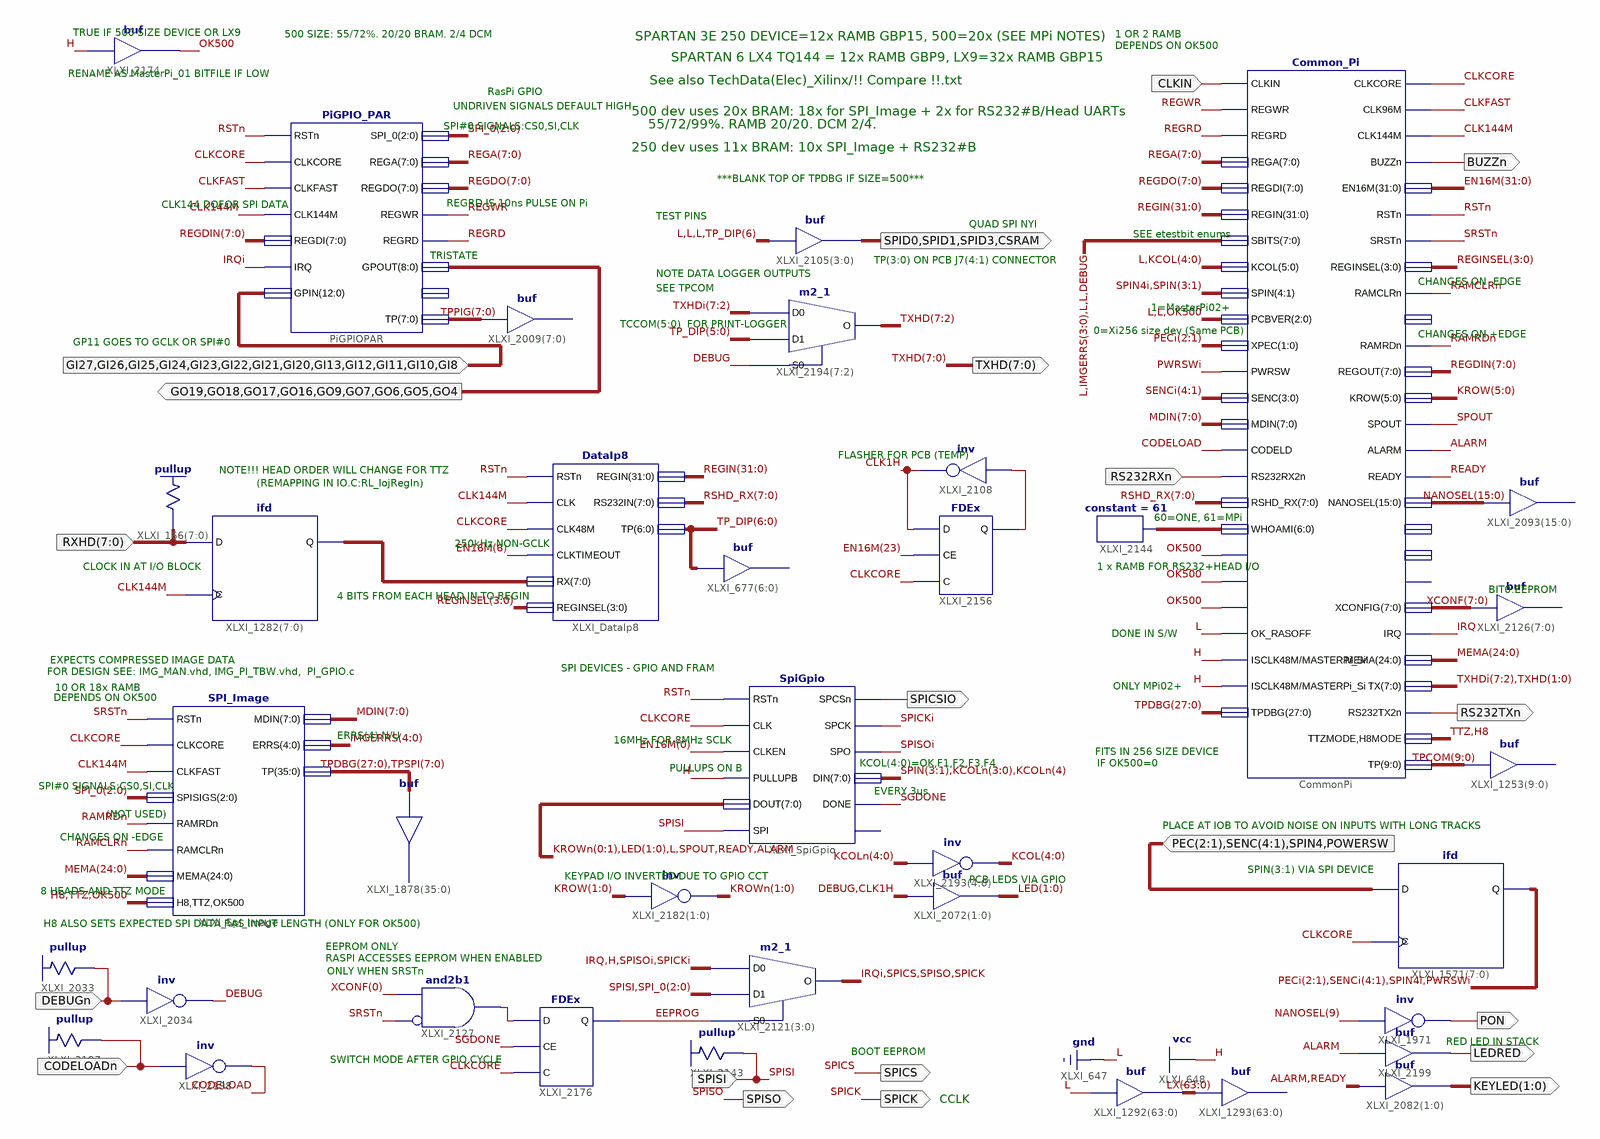
[diagram p0: schematic sheet 1]
// Xilinx ISE schematic MasterPi_02.sch (spartan3e) as structural Verilog: 36 symbols, 20 ports
module MasterPi_02 (
  input  DEBUGn,
  input  [7:0] RXHD,
  input  SPISI,
  input  RS232RXn,
  input  [2:1] PEC,
  input  [4:1] SENC,
  input  SPIN4,
  input  POWERSW,
  input  GI27,
  input  GI26,
  input  GI25,
  input  GI24,
  input  GI23,
  input  GI22,
  input  GI21,
  input  GI20,
  input  GI13,
  input  GI12,
  input  GI11,
  input  GI10,
  input  GI8,
  input  CODELOADn,
  input  CLKIN,
  output [1:0] KEYLED,
  output LEDRED,
  output PON,
  output SPICK,
  output SPICS,
  output SPISO,
  output SPICSIO,
  output BUZZn,
  output RS232TXn,
  output GO19,
  output GO18,
  output GO17,
  output GO16,
  output GO9,
  output GO7,
  output GO6,
  output GO5,
  output GO4,
  output [7:0] TXHD,
  output SPID0,
  output SPID1,
  output SPID3,
  output CSRAM
);

  wire ALARM, CLK1H, CLK144M, CLKCORE, CLKFAST, CODELOAD, DEBUG, EEPROG, H8, IRQ, IRQi, L, OK500, PWRSWi,
       RAMCLRn, RAMRDn, READY, REGRD, REGWR, RSTn, SGDONE, SPICKi, SPIN4i, SPISOi, SPOUT, SRSTn, TTZ,
       XLXN_184, XLXN_379;
  wire [1:0] KROWn, LED;
  wire [2:0] SPI_0;
  wire [2:1] PECi;
  wire [3:0] REGINSEL;
  wire [3:1] SPIN;
  wire [4:0] IMGERRS, KCOL, KCOLn;
  wire [4:1] SENCi;
  wire [5:0] KROW;
  wire [6:0] TP_DIP, XLXN_196;
  wire [7:0] MDIN, REGA, REGDIN, REGDO, RSHD_RX, TPPIG, TPSPI, XCONF, XLXN_33;
  wire [7:2] TXHDi;
  wire [9:0] TPCOM;
  wire [15:0] NANOSEL;
  wire [24:0] MEMA;
  wire [27:0] TPDBG;
  wire [31:0] EN16M, REGIN;
  wire [63:0] LX;

  \pullup  XLXI_2033 (.O(DEBUGn));
  not XLXI_2034 (DEBUG, DEBUGn);
  \pullup  XLXI_166[7:0] (.O(RXHD));
  ifd XLXI_1282[7:0] (.C(CLK144M), .D(RXHD), .Q(XLXN_33));
  assign LX = {64{L}};  // buf XLXI_1292[63..0], 64 bits wide
  // buf XLXI_1293[63..0] has open pins: I=LX, O=open
  assign KEYLED = {ALARM, READY};  // buf XLXI_2082[1..0], 2 bits wide
  not XLXI_1971 (PON, NANOSEL[9]);
  not XLXI_2108 (CLK1H, XLXN_184);
  FDEx XLXI_2156 (.C(CLKCORE), .CE(EN16M[23]), .D(CLK1H), .Q(XLXN_184));
  constant #(.CValue("61")) XLXI_2144 (.O(XLXN_196));
  m2_1 XLXI_2121[3:0] (
    .D0({IRQ, 1'b1, SPISOi, SPICKi}), .D1({SPISI, SPI_0}), .S0(EEPROG), .O({IRQi, SPICS, SPISO, SPICK}));
  \pullup  XLXI_2143 (.O(SPISI));
  ifd XLXI_1571[7:0] (.C(CLKCORE), .D({PEC, SENC, SPIN4, POWERSW}), .Q({PECi, SENCi, SPIN4i, PWRSWi}));
  // buf XLXI_2093[15..0] has open pins: I=NANOSEL, O=open
  // buf XLXI_2126[7..0] has open pins: I=XCONF, O=open
  FDEx XLXI_2176 (.C(CLKCORE), .CE(SGDONE), .D(XLXN_379), .Q(EEPROG));
  and XLXI_2127 (XLXN_379, ~SRSTn, XCONF[0]);  // and2b1
  SpiGpio XLXI_SpiGpio (
    .CLK(CLKCORE), .CLKEN(EN16M[0]), .PULLUPB(1'b1), .DIN({SPIN, KCOLn[3:0], KCOLn[4]}), .DONE(SGDONE),
    .DOUT({KROWn[0], KROWn[1], LED, L, SPOUT, READY, ALARM}), .RSTn(RSTn), .SPCK(SPICKi), .SPCSn(SPICSIO),
    .SPI(SPISI), .SPO(SPISOi));  // open: CYCLE
  assign KROWn = ~KROW[1:0];  // inv XLXI_2182[1..0], 2 bits wide
  assign LED = {DEBUG, CLK1H};  // buf XLXI_2072[1..0], 2 bits wide
  assign KCOL = ~KCOLn;  // inv XLXI_2193[4..0], 5 bits wide
  // buf XLXI_677[6..0] has open pins: I=TP_DIP, O=open
  DataIp8 XLXI_DataIp8 (
    .CLK(CLK144M), .CLK48M(CLKCORE), .CLKTIMEOUT(EN16M[6]), .REGIN(REGIN), .REGINSEL(REGINSEL),
    .RS232IN(RSHD_RX), .RSTn(RSTn), .RX(XLXN_33), .TP(TP_DIP));
  // buf XLXI_2009[7..0] has open pins: I=TPPIG, O=open
  buf XLXI_2174 (OK500, 1'b1);
  // buf XLXI_1253[9..0] has open pins: I=TPCOM, O=open
  \pullup  XLXI_2197 (.O(CODELOADn));
  not XLXI_2198 (CODELOAD, CODELOADn);
  buf XLXI_2199 (LEDRED, ALARM);
  m2_1 XLXI_2194[7:2] (.D0(TXHDi), .D1(TP_DIP[5:0]), .S0(DEBUG), .O(TXHD[7:2]));
  Common_Pi CommonPi (
    .ALARM(ALARM), .BUZZn(BUZZn), .CLK144M(CLK144M), .CLK96M(CLKFAST), .CLKCORE(CLKCORE), .CLKIN(CLKIN),
    .CODELD(CODELOAD), .EN16M(EN16M), .IRQ(IRQ), .ISCLK48M(1'b1), .KCOL({L, KCOL}), .KROW(KROW),
    .MASTERPi_Si(1'b1), .MDIN(MDIN), .MEMA(MEMA), .NANOSEL(NANOSEL), .OK_500(OK500), .OK_RASOFF(L),
    .OK_RS232(OK500), .OK_RSHEAD(OK500), .PCBVER({{2{L}}, OK500}), .PWRSW(PWRSWi), .RAMCLRn(RAMCLRn),
    .RAMRDn(RAMRDn), .READY(READY), .REGA(REGA), .REGDI(REGDO), .REGIN(REGIN), .REGINSEL(REGINSEL),
    .REGOUT(REGDIN), .REGRD(REGRD), .REGWR(REGWR), .RS232RX2n(RS232RXn), .RS232TX2n(RS232TXn),
    .RSHD_RX(RSHD_RX), .RSTn(RSTn), .SENC(SENCi), .SPIN({SPIN4i, SPIN}), .SPOUT(SPOUT), .SRSTn(SRSTn),
    .TP(TPCOM), .SBITS({L, IMGERRS[3:0], {2{L}}, DEBUG}), .TTZMODE(TTZ), .H8MODE(H8),
    .TX({TXHDi, TXHD[1:0]}), .WHOAMI(XLXN_196), .XCONFIG(XCONF), .XPEC(PECi), .TPDBG(TPDBG));  // open: FIRE_EN, HDATA0, HDATA0_EN, HREG0
  assign {SPID0, SPID1, SPID3, CSRAM} = {{3{L}}, TP_DIP[6]};  // buf XLXI_2105[3..0], 4 bits wide
  SPI_Image XLXI_Spi_Image (
    .CLKCORE(CLKCORE), .CLKFAST(CLK144M), .ERRS(IMGERRS), .H8(H8), .TTZ(TTZ), .OK500(OK500), .MDIN(MDIN),
    .MEMA(MEMA), .RAMCLRn(RAMCLRn), .RAMRDn(RAMRDn), .RSTn(SRSTn), .SPISIGS(SPI_0), .TP({TPDBG, TPSPI}));
  // buf XLXI_1878[35..0] has open pins: I={TPDBG, TPSPI}, O=open
  PiGPIO_PAR PiGPIOPAR (
    .CLK144M(CLK144M), .CLKCORE(CLKCORE), .CLKFAST(CLKFAST),
    .GPIN({GI27, GI26, GI25, GI24, GI23, GI22, GI21, GI20, GI13, GI12, GI11, GI10, GI8}),
    .GPOUT({GO19, GO18, GO17, GO16, GO9, GO7, GO6, GO5, GO4}), .IRQ(IRQi), .REGA(REGA), .REGDI(REGDIN),
    .REGDO(REGDO), .REGRD(REGRD), .REGWR(REGWR), .RSTn(RSTn), .SPI_0(SPI_0), .TP(TPPIG));  // open: LASTWR
  // also tied to GND on the sheet: L

  // Notes on the sheet:
  //   TRUE IF 500 SIZE DEVICE OR LX9
  //   500 SIZE: 55/72%. 20/20 BRAM. 2/4 DCM
  //   1 OR 2 RAMB
  //   SPARTAN 3E 250 DEVICE=12x RAMB GBP15, 500=20x (SEE MPi NOTES)
  //   DEPENDS ON OK500
  //   SPARTAN 6 LX4 TQ144 = 12x RAMB GBP9, LX9=32x RAMB GBP15
  //   RENAME AS MasterPi_01 BITFILE IF LOW
  //   See also TechData(Elec)_Xilinx/!! Compare !!.txt
  //   RasPi GPIO
  //   UNDRIVEN SIGNALS DEFAULT HIGH
  //   500 dev uses 20x BRAM: 18x for SPI_Image + 2x for RS232#B/Head UARTs
  //   55/72/99%. RAMB 20/20. DCM 2/4.
  //   SPI#0 SIGNALS:CS0,SI,CLK
  //   250 dev uses 11x BRAM: 10x SPI_Image + RS232#B
  //   ***BLANK TOP OF TPDBG IF SIZE=500***
  //   REGRD IS 10ns PULSE ON Pi
  //   CLK144 DOFOR SPI DATA
  //   TEST PINS
  //   QUAD SPI NYI
  //   SEE etestbit enums
  //   TRISTATE
  //   TP(3:0) ON PCB J7(4:1) CONNECTOR
  //   NOTE DATA LOGGER OUTPUTS
  //   CHANGES ON -EDGE
  //   SEE TPCOM
  //   1=MasterPi02+
  //   TCCOM(5:0)  FOR PRINT-LOGGER
  //   0=Xi256 size dev (Same PCB)
  //   CHANGES ON +EDGE
  //   GP11 GOES TO GCLK OR SPI#0
  //   FLASHER FOR PCB (TEMP)
  //   NOTE!!! HEAD ORDER WILL CHANGE FOR TTZ
  //   (REMAPPING IN IO.C:RL_IojRegIn)
  //   60=ONE, 61=MPi
  //   250kHz NON-GCLK
  //   CLOCK IN AT I/O BLOCK
  //   1 x RAMB FOR RS232+HEAD I/O
  //   BIT0:EEPROM
  //   4 BITS FROM EACH HEAD IN TO REGIN
  //   DONE IN S/W
  //   EXPECTS COMPRESSED IMAGE DATA
  //   SPI DEVICES - GPIO AND FRAM
  //   FOR DESIGN SEE: IMG_MAN.vhd, IMG_PI_TBW.vhd,  PI_GPIO.c
  //   ONLY MPi02+
  //   10 OR 18x RAMB
  //   DEPENDS ON OK500
  //   ERRS(4) N/U
  //   16MHz FOR 8MHz SCLK
  //   FITS IN 256 SIZE DEVICE
  //   KCOL(4:0)=OK,F1,F2,F3,F4
  //   IF OK500=0
  //   PULLUPS ON B
  //   SPI#0 SIGNALS:CS0,SI,CLK
  //   EVERY 3us
  //   (NOT USED)
  //   PLACE AT IOB TO AVOID NOISE ON INPUTS WITH LONG TRACKS
  //   CHANGES ON -EDGE
  //   SPIN(3:1) VIA SPI DEVICE
  //   KEYPAD I/O INVERTED DUE TO GPIO CCT
  //   PCB LEDS VIA GPIO
  //   8 HEADS AND TTZ MODE
  //   H8 ALSO SETS EXPECTED SPI DATA RAS INPUT LENGTH (ONLY FOR OK500)
  //   EEPROM ONLY
  //   RASPI ACCESSES EEPROM WHEN ENABLED
  //   ONLY WHEN SRSTn
  //   RED LED IN STACK
  //   BOOT EEPROM
  //   SWITCH MODE AFTER GPIO CYCLE
  //   CCLK
endmodule
